# EAGLE design remote_v3 (EAGLE 9.6.2)
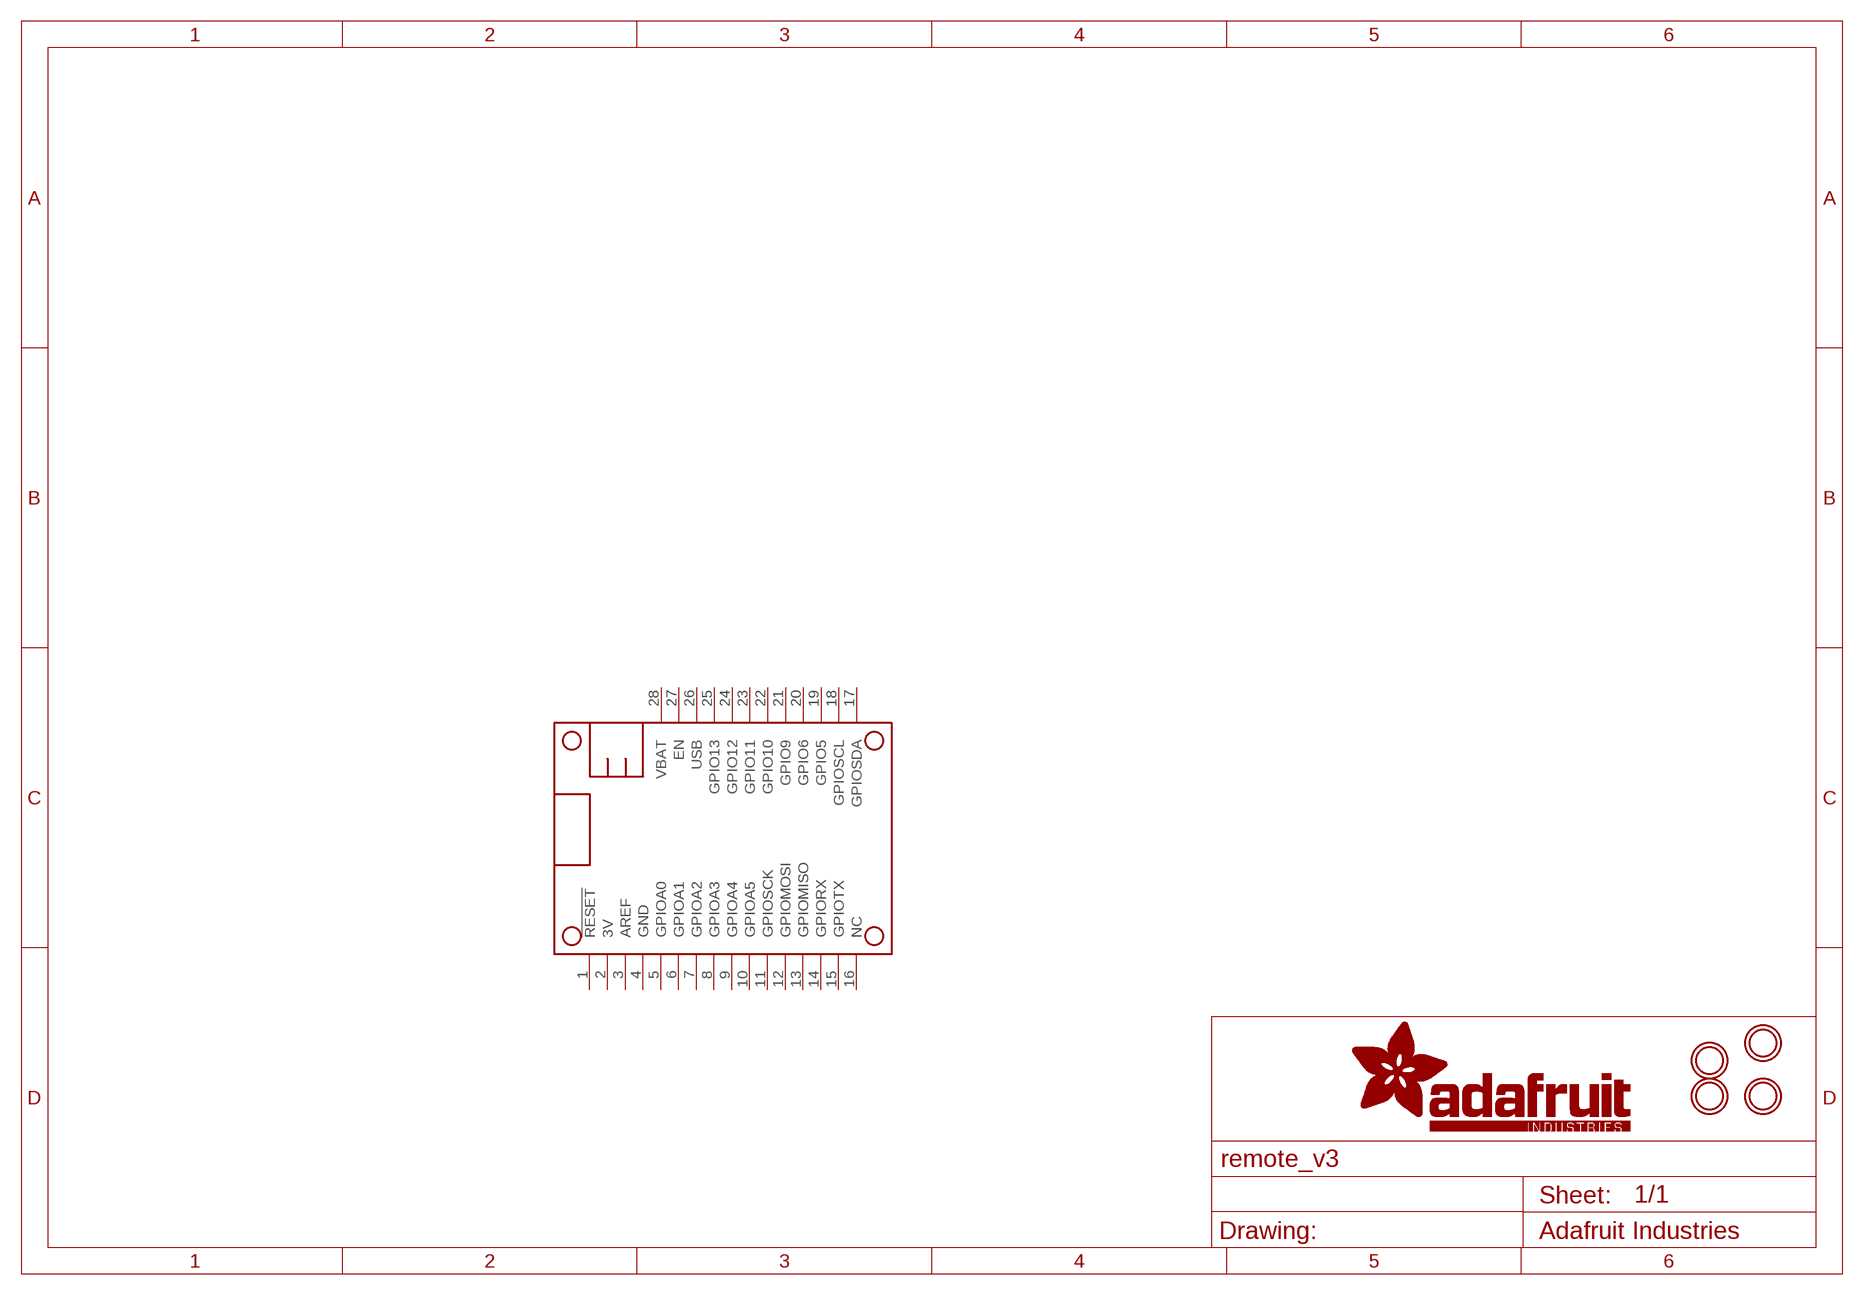
[diagram p0: schematic, sheet 1]

## Parts
MS1  FEATHERWING_NODIM  [FEATHERWING_DIM]
U$2  MOUNTINGHOLE3.0THIN  [MOUNTINGHOLE_3.0_PLATEDTHIN]
U$3  MOUNTINGHOLE3.0THIN  [MOUNTINGHOLE_3.0_PLATEDTHIN]
U$4  MOUNTINGHOLE3.0THIN  [MOUNTINGHOLE_3.0_PLATEDTHIN]
U$5  MOUNTINGHOLE3.0THIN  [MOUNTINGHOLE_3.0_PLATEDTHIN]
Unconnected: MS1.1(!RESET) MS1.2(3V) MS1.3(AREF) MS1.5(GPIOA0) MS1.6(GPIOA1) MS1.7(GPIOA2) MS1.8(GPIOA3) MS1.9(GPIOA4) MS1.10(GPIOA5) MS1.11(GPIOSCK) MS1.12(GPIOMOSI) MS1.13(GPIOMISO) MS1.14(GPIORX) MS1.15(GPIOTX) MS1.16(NC) MS1.17(GPIOSDA) MS1.18(GPIOSCL) MS1.19(GPIO5) MS1.20(GPIO6) MS1.21(GPIO9) MS1.22(GPIO10) MS1.23(GPIO11) MS1.24(GPIO12) MS1.25(GPIO13) MS1.26(USB) MS1.27(EN) MS1.28(VBAT)

## Power pins joined to a net without a drawn wire
GND: MS1.4(GND)

## Library data of the parts
MS1 = microbuilder:FEATHERWING
U$2-U$5 = microbuilder:MOUNTINGHOLE: Mounting Hole For #2 screws (0.086"/2.18mm width, 0.094"/2.4mm hole) use 2.5mm; BOM: EXCLUDE

## Board
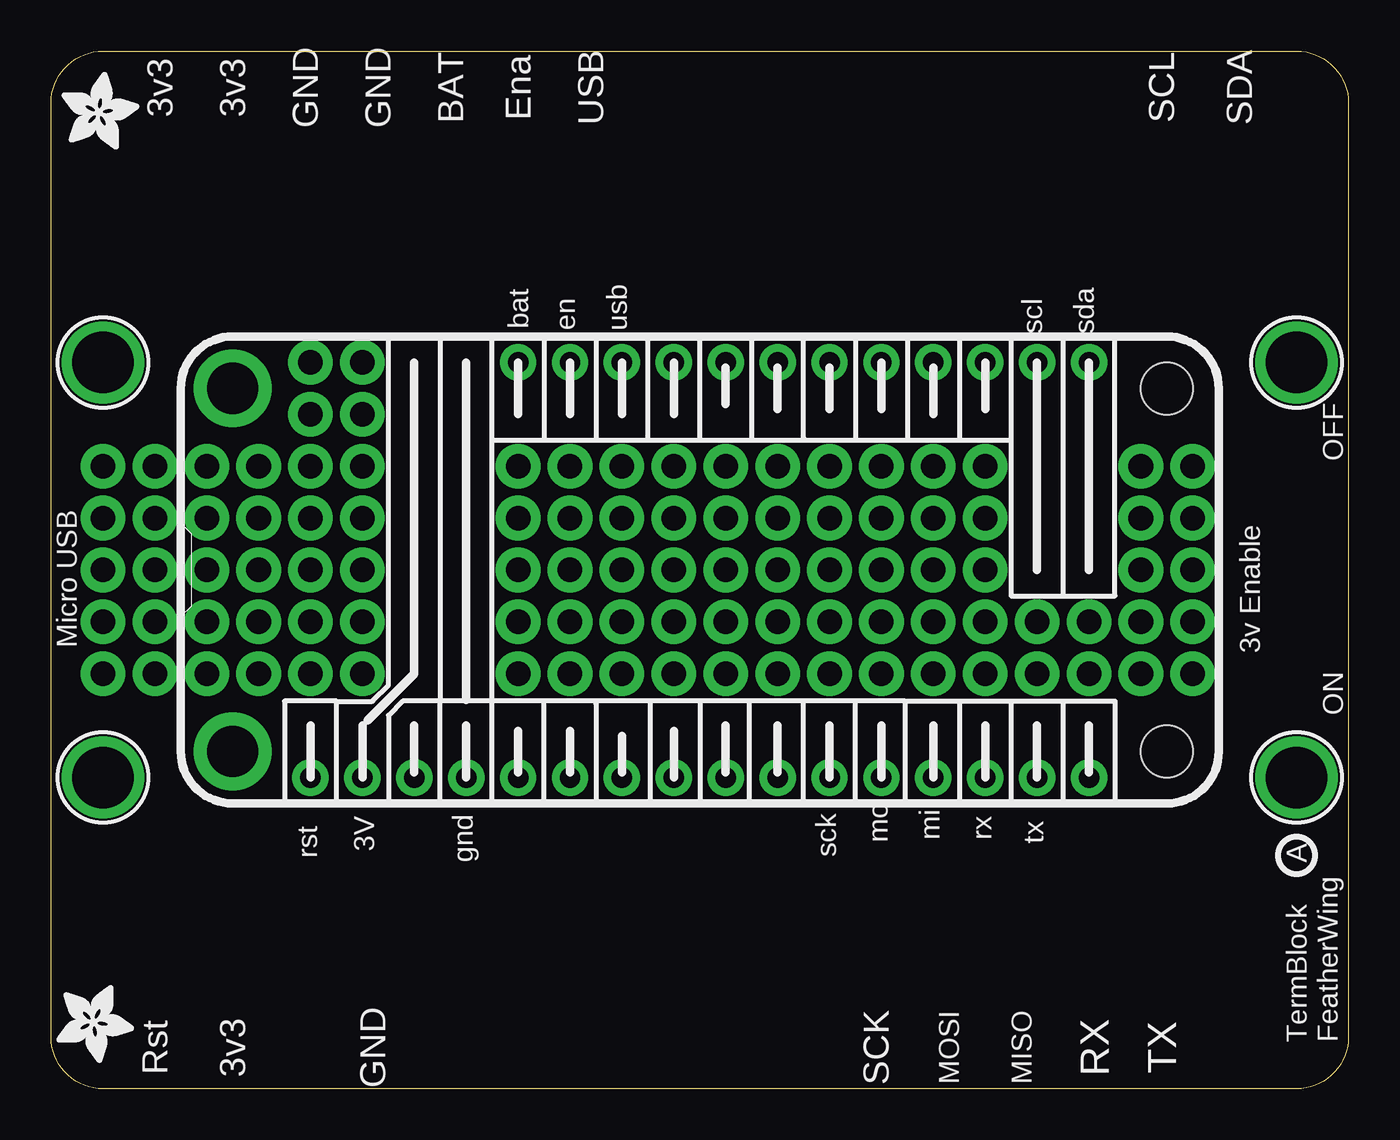
[diagram p1: board, top side]

Size 63.5 x 50.8 mm. Coordinates in mm from the lower left corner, seen from the top.
Outline: 2.54,50.8 60.96,50.8 arc-90 63.5,48.26 63.5,2.54 arc-90 60.96,0 2.54,0 arc-90 0,2.54 0,48.26 arc-90 2.54,50.8
Copper layers (1*16): Top 0.035mm / dielectric 1.5mm / Bottom 0.035mm
Design rules "adafruit": minimum track width 8mil, minimum drill 15.5mil, track to track 8mil, track to pad 8mil, pad to pad 8mil, via to via 8mil, smd to smd 8mil, copper to edge 10mil, drill to drill 8mil, minimum pad ring 10mil, minimum via ring 8mil, stop-mask expansion 2mil, vias tented up to drill 20mil, thermal gap 10mil

### Footprints (pad centres in the part's own frame; a part is rotated, then mirrored left to right if it is on the bottom)
FEATHERWING_DIM = drill 1 pad 1.778: 1 6.35,1.27; 2 8.89,1.27; 3 11.43,1.27; 4 13.97,1.27; 5 16.51,1.27; 6 19.05,1.27; 7 21.59,1.27; 8 24.13,1.27; 9 26.67,1.27; 10 29.21,1.27; 11 31.75,1.27; 12 34.29,1.27; 13 36.83,1.27; 14 39.37,1.27; 15 41.91,1.27; 16 44.45,1.27; 17 44.45,21.59; 18 41.91,21.59; 19 39.37,21.59; 20 36.83,21.59; 21 34.29,21.59; 22 31.75,21.59; 23 29.21,21.59; 24 26.67,21.59; 25 24.13,21.59; 26 21.59,21.59; 27 19.05,21.59; 28 16.51,21.59 | drill 2.5 pad 3.81: P$1 2.54,20.32; P$2 2.54,2.54 | hole 2.54: 48.26,20.32; 48.26,2.54
MOUNTINGHOLE_3.0_PLATEDTHIN = drill 3 pad 3.6: P$1 0,0

### Placement (x,y rotation side)
MS1  6.35,13.97 0 top
U$2  2.54,35.56 0 top
U$3  2.54,15.24 0 top
U$4  60.96,15.24 0 top
U$5  60.96,35.56 0 top
U$6  [PCBFEAT-REV-040]  60.96,11.43 90 top
U$7  [ADAFRUIT_3.5MM]  0.25,5.08 270 top
U$8  [ADAFRUIT_3.5MM]  0.51,45.97 0 top

### Tracks (layer width: path | path; a pad name or v marks a point on that pad's centre or on a via)
N$16  (via drill 1.2 pad 2.18)
  other vias: 5.08,30.48
N$17  (via drill 1.2 pad 2.18)
  other vias: 2.54,30.48
N$24  (via drill 1.2 pad 2.18)
  other vias: 5.08,27.94
N$25  (via drill 1.2 pad 2.18)
  other vias: 2.54,27.94
N$26  (via drill 1.2 pad 2.18)
  other vias: 5.08,25.4
N$27  (via drill 1.2 pad 2.18)
  other vias: 2.54,25.4
N$28  (via drill 1.2 pad 2.18)
  other vias: 5.08,22.86
N$29  (via drill 1.2 pad 2.18)
  other vias: 2.54,22.86
N$30  (via drill 1.2 pad 2.18)
  other vias: 15.24,35.56
N$31  (via drill 1.2 pad 2.18)
  other vias: 15.24,33.02
N$32  (via drill 1.2 pad 2.18)
  other vias: 12.7,33.02
N$33  (via drill 1.2 pad 2.18)
  other vias: 12.7,35.56
N$34  (via drill 1.2 pad 2.18)
  other vias: 12.7,30.48
N$35  (via drill 1.2 pad 2.18)
  other vias: 10.16,30.48
N$36  (via drill 1.2 pad 2.18)
  other vias: 2.54,20.32
N$37  (via drill 1.2 pad 2.18)
  other vias: 7.62,27.94
N$38  (via drill 1.2 pad 2.18)
  other vias: 10.16,27.94
N$39  (via drill 1.2 pad 2.18)
  other vias: 12.7,27.94
N$40  (via drill 1.2 pad 2.18)
  other vias: 12.7,25.4
N$41  (via drill 1.2 pad 2.18)
  other vias: 10.16,25.4
N$42  (via drill 1.2 pad 2.18)
  other vias: 7.62,25.4
N$43  (via drill 1.2 pad 2.18)
  other vias: 7.62,22.86
N$44  (via drill 1.2 pad 2.18)
  other vias: 10.16,22.86
N$45  (via drill 1.2 pad 2.18)
  other vias: 12.7,22.86
N$46  (via drill 1.2 pad 2.18)
  other vias: 12.7,20.32
N$47  (via drill 1.2 pad 2.18)
  other vias: 10.16,20.32
N$48  (via drill 1.2 pad 2.18)
  other vias: 7.62,20.32
N$49  (via drill 1.2 pad 2.18)
  other vias: 15.24,20.32
N$50  (via drill 1.2 pad 2.18)
  other vias: 15.24,22.86
N$51  (via drill 1.2 pad 2.18)
  other vias: 15.24,25.4
N$52  (via drill 1.2 pad 2.18)
  other vias: 15.24,27.94
N$53  (via drill 1.2 pad 2.18)
  other vias: 15.24,30.48
N$54  (via drill 1.2 pad 2.18)
  other vias: 5.08,20.32
N$55  (via drill 1.2 pad 2.18)
  other vias: 7.62,30.48
N$57  (via drill 1.2 pad 2.18)
  other vias: 55.88,30.48
N$64  (via drill 1.2 pad 2.18)
  other vias: 22.86,30.48
N$65  (via drill 1.2 pad 2.18)
  other vias: 25.4,30.48
N$66  (via drill 1.2 pad 2.18)
  other vias: 27.94,30.48
N$67  (via drill 1.2 pad 2.18)
  other vias: 22.86,27.94
N$68  (via drill 1.2 pad 2.18)
  other vias: 22.86,25.4
N$69  (via drill 1.2 pad 2.18)
  other vias: 22.86,22.86
N$70  (via drill 1.2 pad 2.18)
  other vias: 22.86,20.32
N$71  (via drill 1.2 pad 2.18)
  other vias: 25.4,20.32
N$72  (via drill 1.2 pad 2.18)
  other vias: 25.4,22.86
N$73  (via drill 1.2 pad 2.18)
  other vias: 25.4,25.4
N$74  (via drill 1.2 pad 2.18)
  other vias: 25.4,27.94
N$75  (via drill 1.2 pad 2.18)
  other vias: 27.94,27.94
N$76  (via drill 1.2 pad 2.18)
  other vias: 27.94,25.4
N$77  (via drill 1.2 pad 2.18)
  other vias: 27.94,22.86
N$78  (via drill 1.2 pad 2.18)
  other vias: 27.94,20.32
N$79  (via drill 1.2 pad 2.18)
  other vias: 30.48,20.32
N$80  (via drill 1.2 pad 2.18)
  other vias: 30.48,22.86
N$81  (via drill 1.2 pad 2.18)
  other vias: 30.48,30.48
N$82  (via drill 1.2 pad 2.18)
  other vias: 30.48,27.94
N$83  (via drill 1.2 pad 2.18)
  other vias: 30.48,25.4
N$84  (via drill 1.2 pad 2.18)
  other vias: 33.02,20.32
N$85  (via drill 1.2 pad 2.18)
  other vias: 33.02,22.86
N$86  (via drill 1.2 pad 2.18)
  other vias: 33.02,25.4
N$87  (via drill 1.2 pad 2.18)
  other vias: 33.02,27.94
N$88  (via drill 1.2 pad 2.18)
  other vias: 33.02,30.48
N$89  (via drill 1.2 pad 2.18)
  other vias: 35.56,30.48
N$90  (via drill 1.2 pad 2.18)
  other vias: 35.56,27.94
N$91  (via drill 1.2 pad 2.18)
  other vias: 35.56,25.4
N$92  (via drill 1.2 pad 2.18)
  other vias: 35.56,22.86
N$93  (via drill 1.2 pad 2.18)
  other vias: 35.56,20.32
N$94  (via drill 1.2 pad 2.18)
  other vias: 38.1,20.32
N$95  (via drill 1.2 pad 2.18)
  other vias: 38.1,22.86
N$96  (via drill 1.2 pad 2.18)
  other vias: 38.1,25.4
N$97  (via drill 1.2 pad 2.18)
  other vias: 38.1,27.94
N$98  (via drill 1.2 pad 2.18)
  other vias: 38.1,30.48
N$99  (via drill 1.2 pad 2.18)
  other vias: 40.64,30.48
N$100  (via drill 1.2 pad 2.18)
  other vias: 40.64,27.94
N$101  (via drill 1.2 pad 2.18)
  other vias: 40.64,25.4
N$102  (via drill 1.2 pad 2.18)
  other vias: 40.64,22.86
N$103  (via drill 1.2 pad 2.18)
  other vias: 40.64,20.32
N$104  (via drill 1.2 pad 2.18)
  other vias: 43.18,20.32
N$105  (via drill 1.2 pad 2.18)
  other vias: 43.18,22.86
N$106  (via drill 1.2 pad 2.18)
  other vias: 43.18,25.4
N$107  (via drill 1.2 pad 2.18)
  other vias: 43.18,27.94
N$108  (via drill 1.2 pad 2.18)
  other vias: 43.18,30.48
N$109  (via drill 1.2 pad 2.18)
  other vias: 45.72,30.48
N$110  (via drill 1.2 pad 2.18)
  other vias: 45.72,27.94
N$111  (via drill 1.2 pad 2.18)
  other vias: 45.72,25.4
N$112  (via drill 1.2 pad 2.18)
  other vias: 45.72,22.86
N$113  (via drill 1.2 pad 2.18)
  other vias: 45.72,20.32
N$114  (via drill 1.2 pad 2.18)
  other vias: 48.26,20.32
N$118  (via drill 1.2 pad 2.18)
  other vias: 48.26,22.86
N$119  (via drill 1.2 pad 2.18)
  other vias: 50.8,20.32
N$120  (via drill 1.2 pad 2.18)
  other vias: 50.8,22.86
N$124  (via drill 1.2 pad 2.18)
  other vias: 53.34,30.48
N$126  (via drill 1.2 pad 2.18)
  other vias: 55.88,27.94
N$127  (via drill 1.2 pad 2.18)
  other vias: 55.88,25.4
N$128  (via drill 1.2 pad 2.18)
  other vias: 55.88,22.86
N$129  (via drill 1.2 pad 2.18)
  other vias: 55.88,20.32
N$130  (via drill 1.2 pad 2.18)
  other vias: 53.34,20.32
N$131  (via drill 1.2 pad 2.18)
  other vias: 53.34,22.86
N$132  (via drill 1.2 pad 2.18)
  other vias: 53.34,25.4
N$133  (via drill 1.2 pad 2.18)
  other vias: 53.34,27.94

### Text on the board
tPlace: 3v3 | 3v3 | GND | GND | BAT | Ena | USB | SCL | SDA | bat | en | usb | scl | sda | OFF | Micro USB | 3v Enable | ON | mo | mi | rx | tx | rst | 3V | gnd | sck | Rst | 3v3 | GND | SCK | MOSI | MISO | RX | TX | TermBlock / FeatherWing